# Altium schematic sheet A7_BLOCK1.SchDoc
size A4
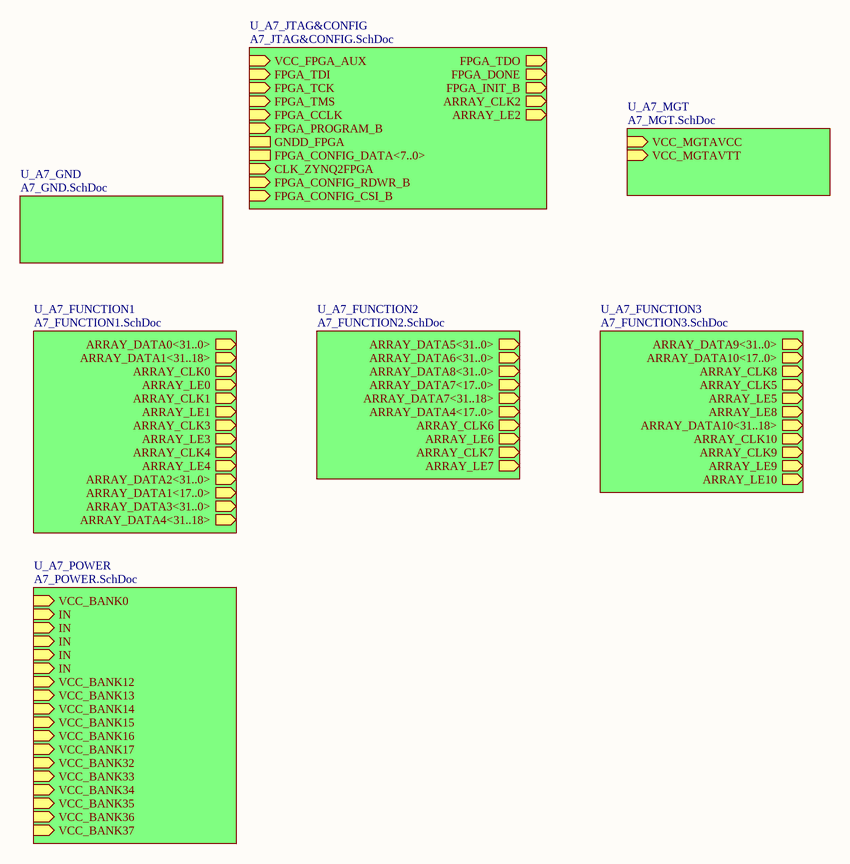
[diagram p0: A7_BLOCK1.SchDoc]

## Sub-sheets
U_A7_FUNCTION1 = A7_FUNCTION1.SchDoc: ARRAY_DATA0<31..0> (out), ARRAY_DATA1<31..18> (out), ARRAY_CLK0 (out), ARRAY_LE0 (out), ARRAY_CLK1 (out), ARRAY_LE1 (out), ARRAY_CLK3 (out), ARRAY_LE3 (out), ARRAY_CLK4 (out), ARRAY_LE4 (out), ARRAY_DATA2<31..0> (out), ARRAY_DATA1<17..0> (out), ARRAY_DATA3<31..0> (out), ARRAY_DATA4<31..18> (out)
U_A7_FUNCTION2 = A7_FUNCTION2.SchDoc: ARRAY_DATA5<31..0> (out), ARRAY_DATA6<31..0> (out), ARRAY_DATA8<31..0> (out), ARRAY_DATA7<17..0> (out), ARRAY_DATA7<31..18> (out), ARRAY_DATA4<17..0> (out), ARRAY_CLK6 (out), ARRAY_LE6 (out), ARRAY_CLK7 (out), ARRAY_LE7 (out)
U_A7_FUNCTION3 = A7_FUNCTION3.SchDoc: ARRAY_DATA9<31..0> (out), ARRAY_DATA10<17..0> (out), ARRAY_CLK8 (out), ARRAY_CLK5 (out), ARRAY_LE5 (out), ARRAY_LE8 (out), ARRAY_DATA10<31..18> (out), ARRAY_CLK10 (out), ARRAY_CLK9 (out), ARRAY_LE9 (out), ARRAY_LE10 (out)
U_A7_GND = A7_GND.SchDoc: no entries
U_A7_JTAG&CONFIG = A7_JTAG&CONFIG.SchDoc: VCC_FPGA_AUX (in), FPGA_TDI (in), FPGA_TDO (out), FPGA_TCK (in), FPGA_TMS (in), FPGA_CCLK (in), FPGA_DONE (out), FPGA_INIT_B (out), FPGA_PROGRAM_B (in), GNDD_FPGA, FPGA_CONFIG_DATA<7..0>, CLK_ZYNQ2FPGA (in), FPGA_CONFIG_RDWR_B (in), FPGA_CONFIG_CSI_B (in), ARRAY_CLK2 (out), ARRAY_LE2 (out)
U_A7_MGT = A7_MGT.SchDoc: VCC_MGTAVCC (in), VCC_MGTAVTT (in)
U_A7_POWER = A7_POWER.SchDoc: VCC_BANK0 (in), IN (in), IN (in), IN (in), IN (in), IN (in), VCC_BANK12 (in), VCC_BANK13 (in), VCC_BANK14 (in), VCC_BANK15 (in), VCC_BANK16 (in), VCC_BANK17 (in), VCC_BANK32 (in), VCC_BANK33 (in), VCC_BANK34 (in), VCC_BANK35 (in), VCC_BANK36 (in), VCC_BANK37 (in)